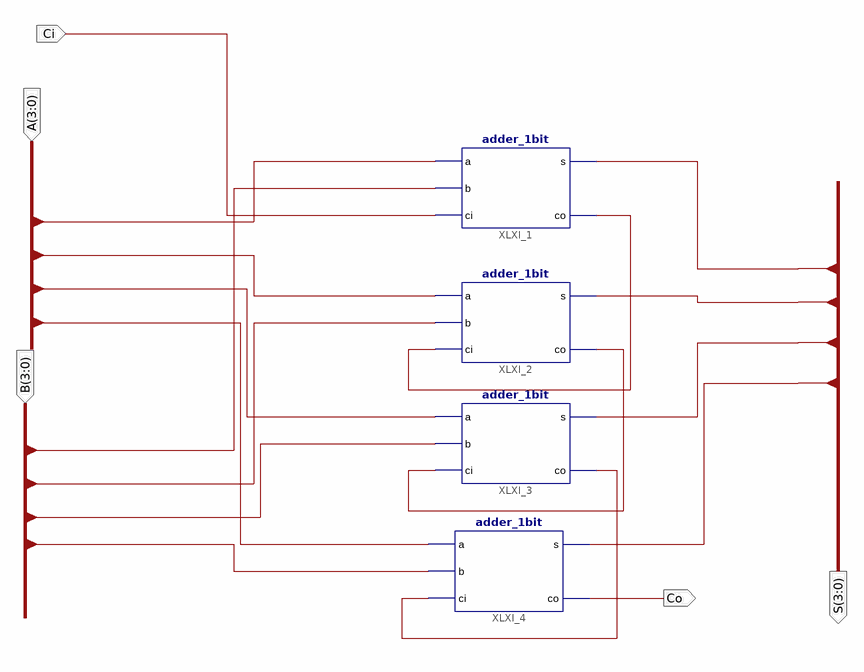
[diagram p0: schematic sheet 1]
// Xilinx ISE schematic Adder4b.sch (kintex7) as structural Verilog: 4 symbols, 5 ports
module Adder4b (
  input  [3:0] A,
  input  [3:0] B,
  input  Ci,
  output [3:0] S,
  output Co
);

  wire XLXN_12, XLXN_14, XLXN_15;

  adder_1bit XLXI_1 (.a(A[0]), .b(B[0]), .ci(Ci), .s(S[0]), .co(XLXN_12));
  adder_1bit XLXI_2 (.a(A[1]), .b(B[1]), .ci(XLXN_12), .s(S[1]), .co(XLXN_14));
  adder_1bit XLXI_3 (.a(A[2]), .b(B[2]), .ci(XLXN_14), .s(S[2]), .co(XLXN_15));
  adder_1bit XLXI_4 (.a(A[3]), .b(B[3]), .ci(XLXN_15), .s(S[3]), .co(Co));
endmodule
